# Altium schematic sheet usb.SchDoc: {Наименование}
size 209 x 297 mm; DocumentNumber: {Обозначение}; SheetNumber: {}; SheetTotal: {}; PageSetup: Record=PageOptions|CenterHorizontal=False|CenterVertical=False|PrintScale=0.95|XCorrection=0.00|YCorrection=0.00|PrintKind=1|BorderSize=5000000|LeftOffset=0|BottomOffset=0|Orientation=1|PaperLength=1000|PaperWidth=1000|Scale=100|PaperSource=15|PrintQuality=600|MediaType=1|DitherType=10|PaperKind=A4|PrintScaleMode=1; Rule: PcbType=ProtelPcb
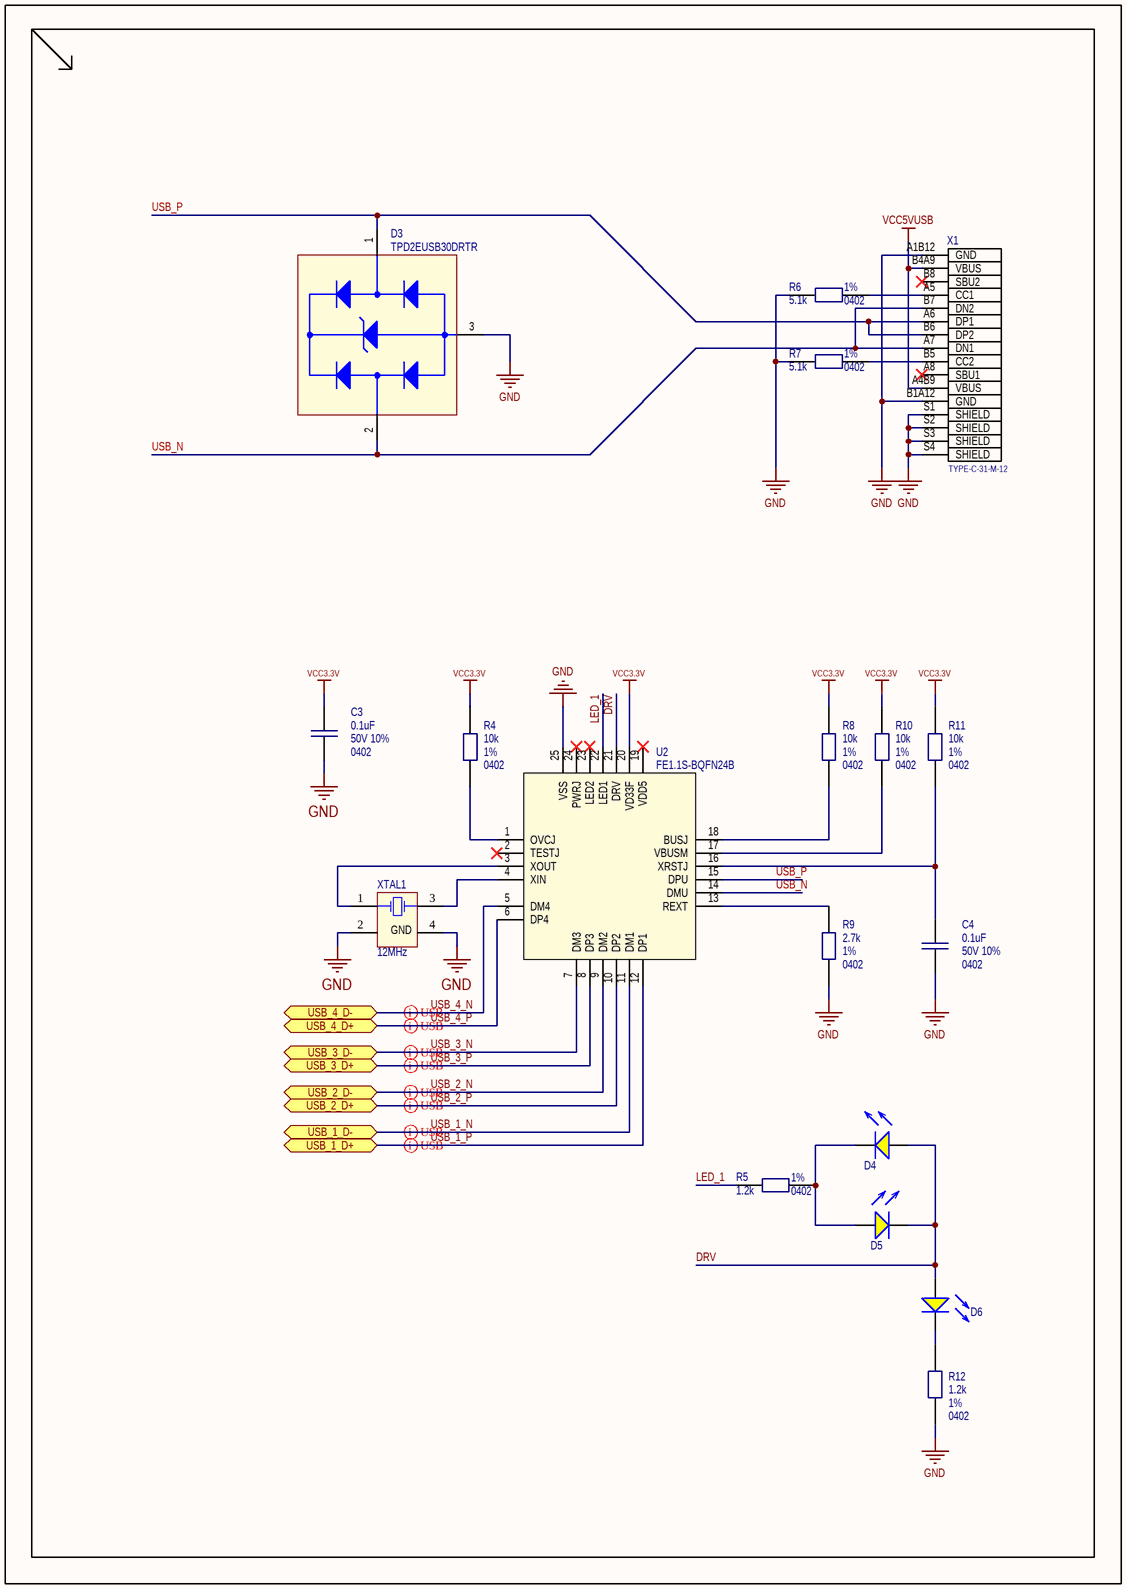
[diagram p0: usb.SchDoc]

## Parts
C3  value 0.1uF  Case/Package: 0402  Tolerance: 50V 10%  [C_0402]  (hidden comment: C0402)
C4  value 0.1uF  Case/Package: 0402  Tolerance: 50V 10%  [C_0402]  (hidden comment: C0402)
D3  TPD2EUSB30DRTR  [SOT-9X3-3]
D4  Yellow 590nm  [LED 0603 YELLOW, 60°]  (value not drawn)
D5  Yellow 590nm  [LED 0603 YELLOW, 60°]  (value not drawn)
D6  Yellow 590nm  [LED 0603 YELLOW, 60°]  (value not drawn)
R4  value 10k  Case/Package: 0402  Tolerance: 1%  [R_0402]  (hidden comment: R0402)
R5  value 1.2k  Case/Package: 0402  Tolerance: 1%  [R_0402]  (hidden comment: R0402)
R6  value 5.1k  Case/Package: 0402  Tolerance: 1%  [R_0402]  (hidden comment: R0402)
R7  value 5.1k  Case/Package: 0402  Tolerance: 1%  [R_0402]  (hidden comment: R0402)
R8  value 10k  Case/Package: 0402  Tolerance: 1%  [R_0402]  (hidden comment: R0402)
R9  value 2.7k  Case/Package: 0402  Tolerance: 1%  [R_0402]  (hidden comment: R0402)
R10  value 10k  Case/Package: 0402  Tolerance: 1%  [R_0402]  (hidden comment: R0402)
R11  value 10k  Case/Package: 0402  Tolerance: 1%  [R_0402]  (hidden comment: R0402)
R12  value 1.2k  Case/Package: 0402  Tolerance: 1%  [R_0402]  (hidden comment: R0402)
U2  FE1.1S-BQFN24B  [QFN50P400X400X80-25N-D]
X1  TYPE-C-31-M-12  [HRO_TYPE-C-31-M-12]
XTAL1  12MHz  [NX3225GA]

## Ports
USB_1_D+ (bidir), USB_1_D- (bidir), USB_2_D+ (bidir), USB_2_D- (bidir), USB_3_D+ (bidir), USB_3_D- (bidir), USB_4_D+ (bidir), USB_4_D- (bidir)

## Nets
GND: C3.1 C4.1 D3.3(I/O2_IN) R6.2 R7.2 R9.1 R12.2 U2.25(VSS) X1.A1B12(GND) X1.B1A12(GND) X1.S1(SHIELD) X1.S2(SHIELD) X1.S3(SHIELD) X1.S4(SHIELD) XTAL1.2(GND) XTAL1.4(GND)
VCC3.3V: C3.2 R4.2 R8.2 R10.2 R11.2 U2.20(VD33F)
VCC5VUSB: X1.A4B9(VBUS) X1.B4A9(VBUS)
DRV: D4.2 D5.1 D6.2 U2.21(DRV)
LED_1: R5.2 U2.22(LED1)
USB_1_N: U2.11(DM1) ; port USB_1_D-
USB_1_P: U2.12(DP1) ; port USB_1_D+
USB_2_N: U2.9(DM2) ; port USB_2_D-
USB_2_P: U2.10(DP2) ; port USB_2_D+
USB_3_N: U2.7(DM3) ; port USB_3_D-
USB_3_P: U2.8(DP3) ; port USB_3_D+
USB_4_N: U2.5(DM4) ; port USB_4_D-
USB_4_P: U2.6(DP4) ; port USB_4_D+
USB_N: D3.2(GND) U2.14(DMU) X1.A7(DN1) X1.B7(DN2)
USB_P: D3.1(I/O1_IN) U2.15(DPU) X1.A6(DP1) X1.B6(DP2)
NetC4_2: C4.2 R11.1 U2.16(XRSTJ)
NetD4_1: D4.1 D5.2 R5.1
NetD6_1: D6.1 R12.1
NetR4_1: R4.1 U2.1(OVCJ)
NetR6_1: R6.1 X1.A5(CC1)
NetR7_1: R7.1 X1.B5(CC2)
NetR8_1: R8.1 U2.18(BUSJ)
NetR9_2: R9.2 U2.13(REXT)
NetR10_1: R10.1 U2.17(VBUSM)
NetU2_3: U2.3(XOUT) XTAL1.1(OSC1)
NetU2_4: U2.4(XIN) XTAL1.3(OSC2)

Not connected (* = marked no-connect by the designer): U2 2(TESTJ)* 19(VDD5)* 23(LED2)* 24(PWRJ)*; X1 A8(SBU1)* B8(SBU2)*

## Layout directives
differential pair; net class USB_MCU; differential pair class USB: USB_2_N, USB_2_P, USB_3_N, USB_3_P, USB_4_N, USB_4_P
differential pair; net class USB_RLINK; differential pair class USB: USB_1_N, USB_1_P

## Library data of the parts
C3 C4 = C0402: Capacitor; Part: CC0402KRX5R9BB104; Alternative Part: *
D3 = TPD2EUSB30DRTR: 2-channel ESD solution for SuperSpeed USB 3.0 interface 3-SOT-9X3 -40 to 85; MF: Texas Instruments; Package: SOT-9X3-3 Texas Instruments; Purchase-URL: https://pricing.snapeda.com/search/part/TPD2EUSB30DRTR/?ref=eda; Value: *; MP: TPD2EUSB30DRTR; Availability: Warning; SnapEDA_Link: https://www.snapeda.com/parts/TPD2EUSB30DRTR/Texas%20Instruments/view-part/189118/?ref=snap; Price: None; Part: TPD2EUSB30DRTR
D4-D6 = YELLOW-LED-0603: YELLOW LED 0603, 60°; Part: APTD1608SYCK; Alternative Part: *; Color: Yellow 590nm
R4 R8 R10 R11 = R0402: Resistor; Part: RC0402FR-0710KL; Alternative Part: *
R5 R12 = R0402: Resistor; Part: RC0402FR-071K2L; Alternative Part: *
R6 R7 = R0402: Resistor; Part: RC0402FR-075K1L; Alternative Part: *
R9 = R0402: Resistor; Part: RC0402FR-072K7L; Alternative Part: *
U2 = FE1.1S-BQFN24B: USB 2.0 HIGH SPEED 4-PORT HUB CONTROLLER; Manufacturer_Name: Terminus Technology; Datasheet Link: https://datasheet.lcsc.com/lcsc/2306141021_Terminus-Tech-FE1-1S-BQFN24B_C6776948.pdf; Height: 0.8mm; Part: FE1.1S-BQFN24B; Alternative Part: *
X1 = TYPE-C-31-M-12: USB Connectors 24 Receptacle 1 8.94*7.3mm RoHS; Package: None; Availability: Unavailable; Value: *; MP: TYPE-C-31-M-12; Price: None; Part: TYPE-C-31-M-12; Alternative Part: *
XTAL1 = SMD3225-4P: Crystal Oscillator; Part: X322512MSB4SI; Alternative Part: *; Value: 12MHz